# Altium schematic sheet Hardware_Architecture.SchDoc: Hardware Architecture
size A2; ApprovedBy: JTS; CheckedBy: JTS; DrawnBy: EBC; DocumentNumber: -; Revision: 09; SheetNumber: 1; SheetTotal: 7; SenaiProjectName: EzPower v4
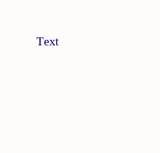
[diagram p0: Hardware_Architecture.SchDoc, left]
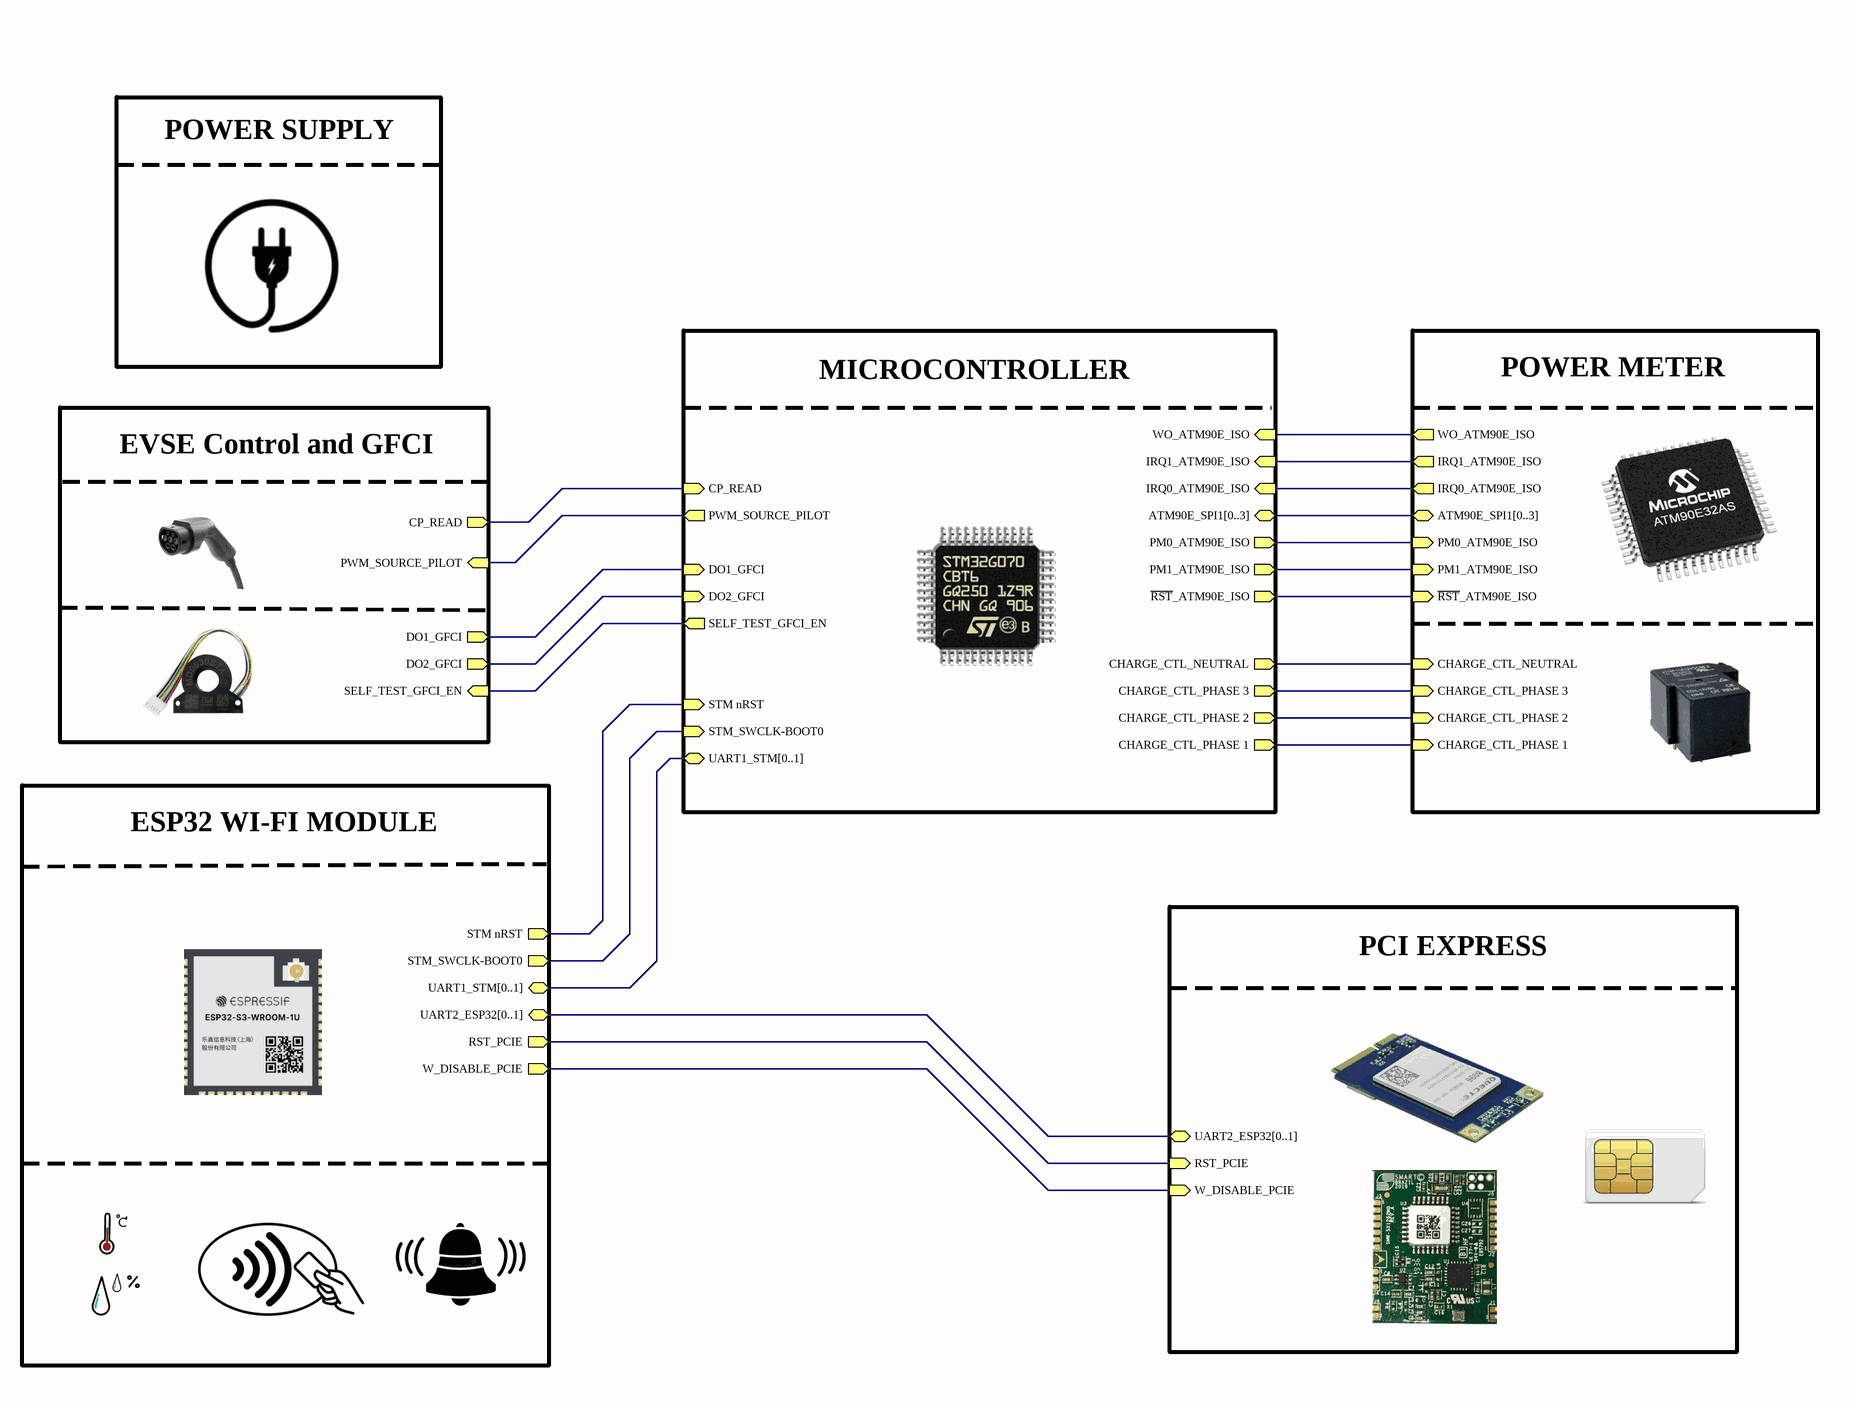
[diagram p1: Hardware_Architecture.SchDoc, right]

## Sub-sheets
ESP32 WI-FI MODULE = ESP32 WI-FI Module.SchDoc: RST_PCIE (out), W_DISABLE_PCIE (out), UART2_ESP32[0..1] (bidir), UART1_STM[0..1] (bidir), STM_SWCLK-BOOT0 (out), STM nRST (out)
EVSE Control and GFCI = EVSE Control and GFCI.SchDoc: PWM_SOURCE_PILOT (in), CP_READ (out), DO2_GFCI (out), DO1_GFCI (out), SELF_TEST_GFCI_EN (in)
MICROCONTROLLER = Microcontroller.SchDoc: PWM_SOURCE_PILOT (out), CP_READ (in), PM0_ATM90E_ISO (out), PM1_ATM90E_ISO (out), IRQ1_ATM90E_ISO (in), IRQ0_ATM90E_ISO (in), WO_ATM90E_ISO (in), ~{RST}_ATM90E_ISO (out), UART1_STM[0..1] (bidir), ATM90E_SPI1[0..3] (bidir), CHARGE_CTL_NEUTRAL (out), CHARGE_CTL_PHASE 3 (out), CHARGE_CTL_PHASE 2 (out), CHARGE_CTL_PHASE 1 (out), SELF_TEST_GFCI_EN (out), DO2_GFCI (in), DO1_GFCI (in), STM nRST (in), STM_SWCLK-BOOT0 (in)
PCI EXPRESS = PCI Express.SchDoc: RST_PCIE (in), UART2_ESP32[0..1] (bidir), W_DISABLE_PCIE (in)
POWER METER = Power Meter.SchDoc: IRQ1_ATM90E_ISO (out), IRQ0_ATM90E_ISO (out), WO_ATM90E_ISO (out), PM1_ATM90E_ISO (in), PM0_ATM90E_ISO (in), ~{RST}_ATM90E_ISO (in), ATM90E_SPI1[0..3] (bidir), CHARGE_CTL_PHASE 2 (in), CHARGE_CTL_PHASE 1 (in), CHARGE_CTL_NEUTRAL (in), CHARGE_CTL_PHASE 3 (in)
POWER SUPPLY = Power Supply.SchDoc: no entries

## Nets
(unnamed): sheet MICROCONTROLLER/PWM_SOURCE_PILOT, sheet EVSE Control and GFCI/PWM_SOURCE_PILOT
(unnamed): sheet MICROCONTROLLER/CP_READ, sheet EVSE Control and GFCI/CP_READ
(unnamed): sheet MICROCONTROLLER/PM0_ATM90E_ISO, sheet POWER METER/PM0_ATM90E_ISO
(unnamed): sheet MICROCONTROLLER/PM1_ATM90E_ISO, sheet POWER METER/PM1_ATM90E_ISO
(unnamed): sheet MICROCONTROLLER/IRQ1_ATM90E_ISO, sheet POWER METER/IRQ1_ATM90E_ISO
(unnamed): sheet MICROCONTROLLER/IRQ0_ATM90E_ISO, sheet POWER METER/IRQ0_ATM90E_ISO
(unnamed): sheet MICROCONTROLLER/~{RST}_ATM90E_ISO, sheet POWER METER/~{RST}_ATM90E_ISO
(unnamed): sheet MICROCONTROLLER/CHARGE_CTL_PHASE 3, sheet POWER METER/CHARGE_CTL_PHASE 3
(unnamed): sheet MICROCONTROLLER/CHARGE_CTL_PHASE 2, sheet POWER METER/CHARGE_CTL_PHASE 2
(unnamed): sheet MICROCONTROLLER/CHARGE_CTL_PHASE 1, sheet POWER METER/CHARGE_CTL_PHASE 1
(unnamed): sheet MICROCONTROLLER/SELF_TEST_GFCI_EN, sheet EVSE Control and GFCI/SELF_TEST_GFCI_EN
(unnamed): sheet MICROCONTROLLER/DO2_GFCI, sheet EVSE Control and GFCI/DO2_GFCI
(unnamed): sheet MICROCONTROLLER/STM nRST, sheet ESP32 WI-FI MODULE/STM nRST
(unnamed): sheet MICROCONTROLLER/STM_SWCLK-BOOT0, sheet ESP32 WI-FI MODULE/STM_SWCLK-BOOT0
(unnamed): sheet ESP32 WI-FI MODULE/RST_PCIE, sheet PCI EXPRESS/RST_PCIE
(unnamed): sheet ESP32 WI-FI MODULE/W_DISABLE_PCIE, sheet PCI EXPRESS/W_DISABLE_PCIE

## Buses and harness runs
bus sheet ESP32 WI-FI MODULE/UART1_STM[0..1] = sheet MICROCONTROLLER/UART1_STM[0..1]
bus sheet ESP32 WI-FI MODULE/UART2_ESP32[0..1] = sheet PCI EXPRESS/UART2_ESP32[0..1]

## Notes on the sheet
- Text
- Title:
- Size:
- Project:
- Revision:
- Date:
- Time:
- Variant:
- Drawn by:
- Checked by:
- A2
- Approved by:
- Sheet
- of